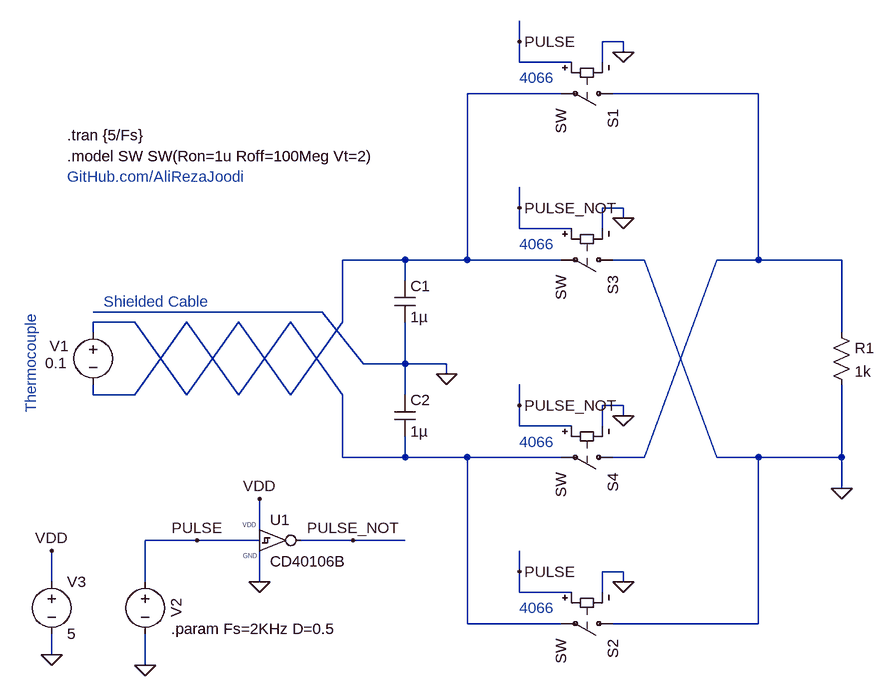
[diagram p0: schematic v1.0.asc]
v1.0.asc, the LTspice schematic file:
Version 4.1
SHEET 1 880 1332
WIRE 176 -416 176 -448
WIRE 336 -416 304 -416
WIRE 336 -400 336 -416
WIRE 176 -384 176 -416
WIRE 256 -384 176 -384
WIRE 304 -384 304 -416
WIRE 240 -336 96 -336
WIRE 544 -336 320 -336
WIRE 176 -160 176 -192
WIRE 336 -160 304 -160
WIRE 336 -144 336 -160
WIRE 176 -128 176 -160
WIRE 256 -128 176 -128
WIRE 304 -128 304 -160
WIRE 0 -80 -96 -80
WIRE 96 -80 96 -336
WIRE 96 -80 0 -80
WIRE 240 -80 96 -80
WIRE 368 -80 320 -80
WIRE 544 -80 544 -336
WIRE 544 -80 480 -80
WIRE 672 -80 544 -80
WIRE 0 -48 0 -80
WIRE -128 0 -480 0
WIRE -416 16 -480 16
WIRE -96 16 -96 -80
WIRE -480 32 -480 16
WIRE 672 32 672 -80
WIRE -64 80 -128 0
WIRE 0 80 0 16
WIRE 0 80 -64 80
WIRE 64 80 0 80
WIRE 64 96 64 80
WIRE -480 128 -480 112
WIRE -416 128 -336 16
WIRE -416 128 -480 128
WIRE -336 128 -416 16
WIRE -336 128 -256 16
WIRE -256 128 -336 16
WIRE -256 128 -176 16
WIRE -176 128 -256 16
WIRE -176 128 -96 16
WIRE -96 128 -176 16
WIRE 0 128 0 80
WIRE 176 144 176 112
WIRE 336 144 304 144
WIRE 336 160 336 144
WIRE 176 176 176 144
WIRE 256 176 176 176
WIRE 304 176 304 144
WIRE -96 224 -96 128
WIRE 0 224 0 192
WIRE 0 224 -96 224
WIRE 96 224 0 224
WIRE 240 224 96 224
WIRE 368 224 480 -80
WIRE 368 224 320 224
WIRE 480 224 368 -80
WIRE 544 224 480 224
WIRE 672 224 672 112
WIRE 672 224 544 224
WIRE 672 272 672 224
WIRE -224 336 -224 288
WIRE -320 352 -400 352
WIRE -224 352 -320 352
WIRE -80 352 -160 352
WIRE 0 352 -80 352
WIRE 176 400 176 368
WIRE 336 400 304 400
WIRE -544 416 -544 368
WIRE -400 416 -400 352
WIRE -224 416 -224 368
WIRE 336 416 336 400
WIRE 176 432 176 400
WIRE 256 432 176 432
WIRE 304 432 304 400
WIRE 96 480 96 224
WIRE 240 480 96 480
WIRE 544 480 544 224
WIRE 544 480 320 480
WIRE -544 528 -544 496
WIRE -400 544 -400 496
FLAG 672 272 0
FLAG 64 96 0
FLAG 336 -400 0
FLAG 336 -144 0
FLAG 336 160 0
FLAG 336 416 0
FLAG 176 -416 PULSE
FLAG 176 400 PULSE
FLAG 176 -160 PULSE_NOT
FLAG 176 144 PULSE_NOT
FLAG -400 544 0
FLAG -544 528 0
FLAG -544 368 VDD
FLAG -224 416 0
FLAG -224 288 VDD
FLAG -320 352 PULSE
FLAG -80 352 PULSE_NOT
SYMBOL voltage -480 16 R0
WINDOW 123 0 0 Left 0
WINDOW 39 0 0 Left 0
WINDOW 0 -67 37 Left 2
WINDOW 3 -74 63 Left 2
SYMATTR InstName V1
SYMATTR Value 0.1
SYMBOL sw 336 -336 R90
SYMATTR InstName S1
SYMBOL voltage -400 400 R0
WINDOW 0 32 56 VTop 2
WINDOW 3 -32 56 Invisible 2
WINDOW 123 0 0 Left 0
WINDOW 39 0 0 Left 0
SYMATTR InstName V2
SYMATTR Value PULSE(0 5 0 1n 1n {D/Fs} {1/Fs})
SYMBOL res 656 16 R0
SYMATTR InstName R1
SYMATTR Value 1k
SYMBOL sw 336 480 R90
SYMATTR InstName S2
SYMBOL sw 336 -80 R90
SYMATTR InstName S3
SYMBOL sw 336 224 R90
SYMATTR InstName S4
SYMBOL cap -16 -48 R0
SYMATTR InstName C1
SYMATTR Value 1µ
SYMBOL cap -16 128 R0
SYMATTR InstName C2
SYMATTR Value 1µ
SYMBOL MyLib\\Digital\\CD40106B -224 320 R0
SYMATTR InstName U1
SYMBOL voltage -544 400 R0
WINDOW 123 0 0 Left 0
WINDOW 39 0 0 Left 0
SYMATTR InstName V3
SYMATTR Value 5
TEXT -520 -240 Left 2 !.model SW SW(Ron=1u Roff=100Meg Vt=2)
TEXT -520 -272 Left 2 !.tran {5/Fs}
TEXT -360 488 Left 2 !.param Fs=2KHz D=0.5
TEXT -576 0 VRight 2 ;Thermocouple
TEXT -464 -16 Left 2 ;Shielded Cable
TEXT 176 -360 Left 2 ;4066
TEXT 176 -104 Left 2 ;4066
TEXT 176 200 Left 2 ;4066
TEXT 176 456 Left 2 ;4066
TEXT -520 -208 Left 2 ;GitHub.com/AliRezaJoodi

The netlist it stands for:
* v1.0.asc
V1 N001 N003 0.1
S1 N002 N001 PULSE 0 SW
V2 PULSE 0 PULSE(0 5 0 1n 1n {D/Fs} {1/Fs})
R1 N002 0 1k
S2 0 N003 PULSE 0 SW
S3 0 N001 PULSE_NOT 0 SW
S4 N002 N003 PULSE_NOT 0 SW
C1 N001 0 1µ
C2 0 N003 1µ
X§U1 PULSE PULSE_NOT VDD 0 CD40106B vdd=5 speed=2 tripdt=100n  ; pins in out VDD GND
V3 VDD 0 5
.model SW SW(Ron=1u Roff=100Meg Vt=2)
.tran {5/Fs}
.param Fs=2KHz D=0.5
* Thermocouple
* Shielded Cable
* 4066
* 4066
* 4066
* 4066
* GitHub.com/AliRezaJoodi
.lib MyLib/Digital/_CD4xxx.lib
.backanno
.end